# Altium schematic sheet Sheet_2812b.SchDoc
size A4
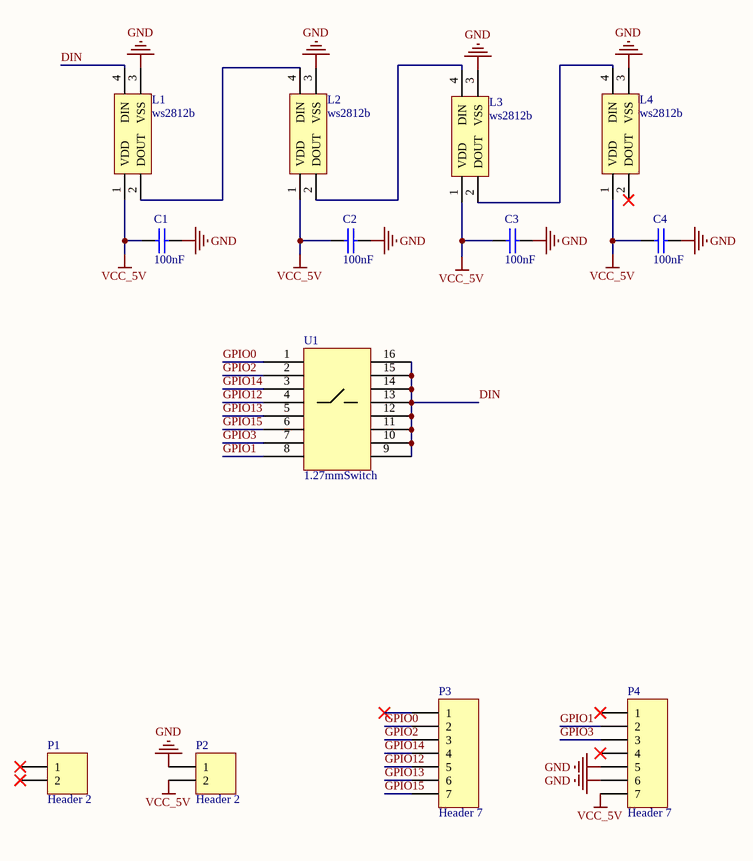
[diagram p0: Sheet_2812b.SchDoc]

## Parts
C1  100nF  [C0603]
C2  100nF  [C0603]
C3  100nF  [C0603]
C4  100nF  [C0603]
L1  ws2812b  [ws2812b]
L2  ws2812b  [ws2812b]
L3  ws2812b  [ws2812b]
L4  ws2812b  [ws2812b]
P1  Header 2  [HDR1X2]
P2  Header 2  [HDR1X2]
P3  Header 7  [HDR1X7]
P4  Header 7  [HDR1X7]
U1  1.27mmSwitch  [NumberSwitch]

## Nets
GND: C1.2 C2.2 C3.2 C4.2 L1.3(VSS) L2.3(VSS) L3.3(VSS) L4.3(VSS) P2.1 P4.5 P4.6
VCC_5V: C1.1 C2.1 C3.1 C4.1 L1.1(VDD) L2.1(VDD) L3.1(VDD) L4.1(VDD) P2.2 P4.7
DIN: L1.4(DIN) U1.9 U1.10 U1.11 U1.12 U1.13 U1.14 U1.15 U1.16
GPIO0: P3.2 U1.1
GPIO1: P4.2 U1.8
GPIO2: P3.3 U1.2
GPIO3: P4.3 U1.7
GPIO12: P3.5 U1.4
GPIO13: P3.6 U1.5
GPIO14: P3.4 U1.3
GPIO15: P3.7 U1.6
NetL1_2: L1.2(DOUT) L2.4(DIN)
NetL2_2: L2.2(DOUT) L3.4(DIN)
NetL3_2: L3.2(DOUT) L4.4(DIN)

Not connected (* = marked no-connect by the designer): L4 2(DOUT)*; P1 1* 2*; P3 1*; P4 1* 4*

## Library data of the parts
C1-C4 = C0603: 贴片电容
L1-L4 = ws2812b: RGB灯珠
P1 P2 = Header 2: Header, 2-Pin; LatestRevisionDate: 17-Jul-2002; LatestRevisionNote: Re-released for DXP Platform.; Publisher: Altium Limited
P3 P4 = Header 7: Header, 7-Pin; LatestRevisionDate: 17-Jul-2002; LatestRevisionNote: Re-released for DXP Platform.; Publisher: Altium Limited
U1 = NumberSwitch: 拨码开关